# Altium schematic sheet POV_LED.SchDoc
size A4
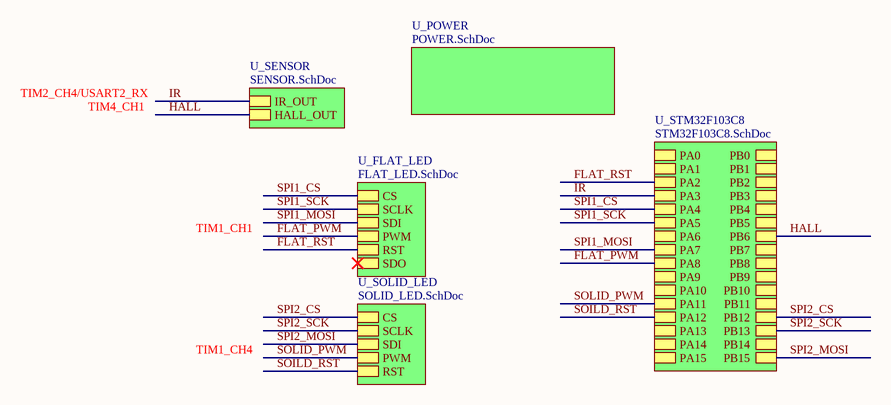
[diagram p0: POV_LED.SchDoc]

## Sub-sheets
U_FLAT_LED = FLAT_LED.SchDoc: SCLK, CS, RST, PWM, SDI, SDO
U_POWER = POWER.SchDoc: no entries
U_SENSOR = SENSOR.SchDoc: IR_OUT, HALL_OUT
U_SOLID_LED = SOLID_LED.SchDoc: SCLK, CS, RST, PWM, SDI
U_STM32F103C8 = STM32F103C8.SchDoc: PA0, PA1, PA2, PA3, PA4, PA5, PA6, PA7, PA8, PA9, PA10, PA11, PA12, PA13, PA14, PA15, PB0, PB1, PB2, PB3, PB4, PB5, PB6, PB7, PB8, PB9, PB10, PB11, PB12, PB13, PB14, PB15

## Nets
FLAT_PWM: sheet U_FLAT_LED/PWM, sheet U_STM32F103C8/PA8
FLAT_RST: sheet U_FLAT_LED/RST, sheet U_STM32F103C8/PA2
HALL: sheet U_STM32F103C8/PB6, sheet U_SENSOR/HALL_OUT
IR: sheet U_STM32F103C8/PA3, sheet U_SENSOR/IR_OUT
SOILD_RST: sheet U_SOLID_LED/RST, sheet U_STM32F103C8/PA12
SOLID_PWM: sheet U_SOLID_LED/PWM, sheet U_STM32F103C8/PA11
SPI1_CS: sheet U_FLAT_LED/CS, sheet U_STM32F103C8/PA4
SPI1_MOSI: sheet U_FLAT_LED/SDI, sheet U_STM32F103C8/PA7
SPI1_SCK: sheet U_FLAT_LED/SCLK, sheet U_STM32F103C8/PA5
SPI2_CS: sheet U_SOLID_LED/CS, sheet U_STM32F103C8/PB12
SPI2_MOSI: sheet U_SOLID_LED/SDI, sheet U_STM32F103C8/PB15
SPI2_SCK: sheet U_SOLID_LED/SCLK, sheet U_STM32F103C8/PB13

## Notes on the sheet
- TIM2_CH4/USART2_RX
- TIM4_CH1
- TIM1_CH1
- TIM1_CH4